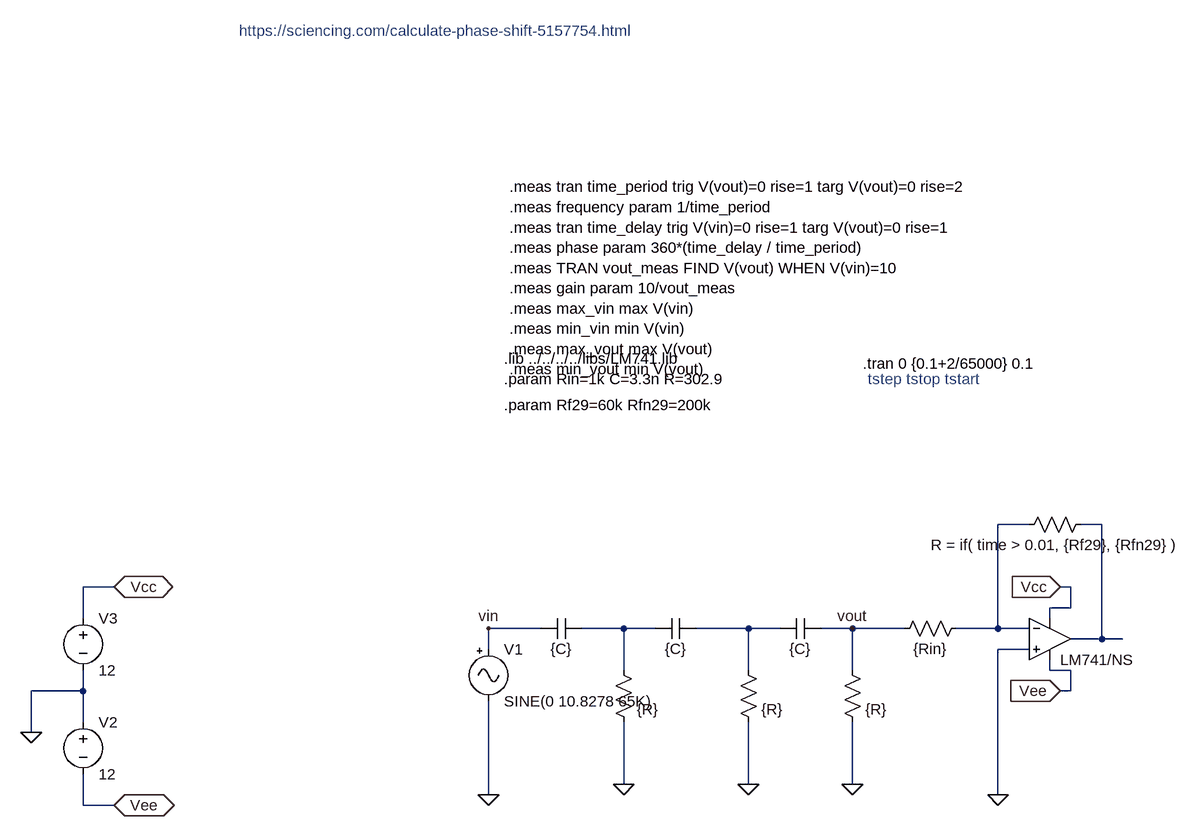
[diagram p0: schematic debugB_theorical.asc]
debugB_theorical.asc, the LTspice schematic file:
Version 4
SHEET 1 1332 1128
WIRE 704 -176 656 -176
WIRE 816 -176 784 -176
WIRE -704 -80 -752 -80
WIRE 768 -80 752 -80
WIRE 768 -48 768 -80
WIRE 768 -48 736 -48
WIRE -752 -32 -752 -80
WIRE 736 -32 736 -48
WIRE -48 -16 -128 -16
WIRE 80 -16 16 -16
WIRE 128 -16 80 -16
WIRE 272 -16 192 -16
WIRE 320 -16 272 -16
WIRE 432 -16 384 -16
WIRE 512 -16 432 -16
WIRE 656 -16 656 -176
WIRE 656 -16 592 -16
WIRE 704 -16 656 -16
WIRE 816 0 816 -176
WIRE 816 0 768 0
WIRE 848 0 816 0
WIRE -128 16 -128 -16
WIRE 704 16 656 16
WIRE 80 48 80 -16
WIRE 272 48 272 -16
WIRE 432 48 432 -16
WIRE 736 48 736 32
WIRE 768 48 736 48
WIRE -752 80 -752 48
WIRE -752 80 -832 80
WIRE 768 80 768 48
WIRE 768 80 752 80
WIRE -752 128 -752 80
WIRE -832 144 -832 80
WIRE 80 224 80 128
WIRE 272 224 272 128
WIRE 432 224 432 128
WIRE -128 240 -128 96
WIRE 656 240 656 16
WIRE -752 256 -752 208
WIRE -704 256 -752 256
FLAG 80 224 0
FLAG 272 224 0
FLAG 752 -80 Vcc
IOPIN 752 -80 In
FLAG 752 80 Vee
IOPIN 752 80 In
FLAG 656 240 0
FLAG 432 224 0
FLAG -832 144 0
FLAG -704 -80 Vcc
IOPIN -704 -80 BiDir
FLAG -704 256 Vee
IOPIN -704 256 BiDir
FLAG 432 -16 vout
FLAG -128 -16 vin
FLAG -128 240 0
SYMBOL opamp2 736 -64 R0
WINDOW 0 16 32 Invisible 2
SYMATTR InstName U1
SYMATTR Value LM741/NS
SYMBOL res 800 -192 R90
WINDOW 0 0 56 Invisible 2
WINDOW 3 32 56 VTop 2
SYMATTR InstName R1
SYMATTR Value R = if( time > 0.01, {Rf29}, {Rfn29} )
SYMBOL res 608 -32 R90
WINDOW 0 0 56 Invisible 2
WINDOW 3 32 56 VTop 2
SYMATTR InstName R2
SYMATTR Value {Rin}
SYMBOL cap 16 -32 R90
WINDOW 0 0 32 Invisible 2
WINDOW 3 32 32 VTop 2
SYMATTR InstName C1
SYMATTR Value {C}
SYMBOL cap 192 -32 R90
WINDOW 0 0 32 Invisible 2
WINDOW 3 32 32 VTop 2
SYMATTR InstName C2
SYMATTR Value {C}
SYMBOL cap 384 -32 R90
WINDOW 0 0 32 Invisible 2
WINDOW 3 32 32 VTop 2
SYMATTR InstName C3
SYMATTR Value {C}
SYMBOL res 64 32 R0
WINDOW 0 36 40 Invisible 2
SYMATTR InstName R3
SYMATTR Value {R}
SYMBOL res 256 32 R0
WINDOW 0 36 40 Invisible 2
SYMATTR InstName R4
SYMATTR Value {R}
SYMBOL res 416 32 R0
WINDOW 0 36 40 Invisible 2
SYMATTR InstName R5
SYMATTR Value {R}
SYMBOL voltage -752 112 R0
SYMATTR InstName V2
SYMATTR Value 12
SYMBOL voltage -752 -48 R0
SYMATTR InstName V3
SYMATTR Value 12
SYMBOL Misc/signal -128 0 R0
SYMATTR InstName V1
SYMATTR Value SINE(0 10.8278 65K)
TEXT -104 -432 Left 2 !.lib ../../../../libs/LM741.lib
TEXT -104 -400 Left 2 !.param Rin=1k C=3.3n R=302.9
TEXT 448 -424 Left 2 !.tran 0 {0.1+2/65000} 0.1
TEXT 456 -400 Left 2 ;tstep tstop tstart
TEXT -104 -360 Left 2 !.param Rf29=60k Rfn29=200k
TEXT -96 -696 Left 2 !.meas tran time_period trig V(vout)=0 rise=1 targ V(vout)=0 rise=2\n.meas frequency param 1/time_period\n.meas tran time_delay trig V(vin)=0 rise=1 targ V(vout)=0 rise=1\n.meas phase param 360*(time_delay / time_period)\n.meas TRAN vout_meas FIND V(vout) WHEN V(vin)=10\n.meas gain param 10/vout_meas\n.meas max_vin max V(vin)\n.meas min_vin min V(vin)\n.meas max_vout max V(vout)\n.meas min_vout min V(vout)
TEXT -512 -936 Left 2 ;https://sciencing.com/calculate-phase-shift-5157754.html

The netlist it stands for:
* debugB_theorical.asc
XU1 0 N001 Vcc Vee N002 LM741/NS  ; pins In+ In- V+ V- OUT
R1 N002 N001 R = if( time > 0.01, {Rf29}, {Rfn29} )
R2 N001 vout {Rin}
C1 N003 vin {C}
C2 N004 N003 {C}
C3 vout N004 {C}
R3 N003 0 {R}
R4 N004 0 {R}
R5 vout 0 {R}
V2 0 Vee 12
V3 Vcc 0 12
V1 vin 0 SINE(0 10.8278 65K)
.lib ../../../../libs/LM741.lib
.param Rin=1k C=3.3n R=302.9
.tran 0 {0.1+2/65000} 0.1
* tstep tstop tstart
.param Rf29=60k Rfn29=200k
.meas tran time_period trig V(vout)=0 rise=1 targ V(vout)=0 rise=2
.meas frequency param 1/time_period
.meas tran time_delay trig V(vin)=0 rise=1 targ V(vout)=0 rise=1
.meas phase param 360*(time_delay / time_period)
.meas TRAN vout_meas FIND V(vout) WHEN V(vin)=10
.meas gain param 10/vout_meas
.meas max_vin max V(vin)
.meas min_vin min V(vin)
.meas max_vout max V(vout)
.meas min_vout min V(vout)
* https://sciencing.com/calculate-phase-shift-5157754.html
.backanno
.end